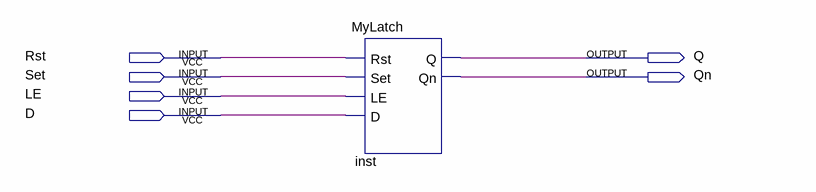
[diagram p0: schematic sheet]
// Quartus schematic latchtester.bdf as structural Verilog: 1 symbols, 6 pins
module latchtester (
  input  Rst,
  input  Set,
  input  LE,
  input  D,
  output Q,
  output Qn
);

  MyLatch inst (.Rst(Rst), .Set(Set), .LE(LE), .D(D), .Q(Q), .Qn(Qn));
endmodule
